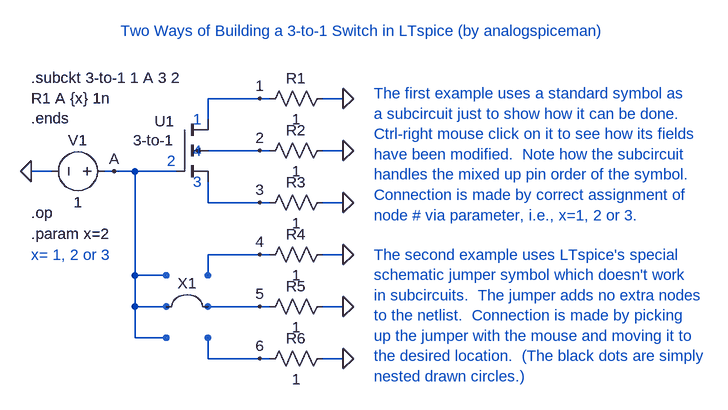
[diagram p0: schematic 3-to-1.asc]
3-to-1.asc, the LTspice schematic file:
Version 4
SHEET 1 880 680
WIRE 144 160 64 160
WIRE 160 160 144 160
WIRE 272 160 240 160
WIRE 64 192 64 160
WIRE 144 240 64 240
WIRE 160 240 144 240
WIRE 272 240 240 240
WIRE -176 272 -208 272
WIRE -80 272 -96 272
WIRE -48 272 -80 272
WIRE 16 272 -48 272
WIRE 64 320 64 288
WIRE 144 320 64 320
WIRE 160 320 144 320
WIRE 272 320 240 320
WIRE 144 400 64 400
WIRE 160 400 144 400
WIRE 272 400 240 400
WIRE -48 432 -48 272
WIRE 0 432 -48 432
WIRE 64 432 64 400
WIRE -48 480 -48 432
WIRE 0 480 -48 480
WIRE 144 480 64 480
WIRE 160 480 144 480
WIRE 272 480 240 480
WIRE -48 528 -48 480
WIRE 0 528 -48 528
WIRE 64 560 64 528
WIRE 144 560 64 560
WIRE 160 560 144 560
WIRE 272 560 240 560
FLAG -208 272 0
FLAG 272 160 0
FLAG 272 240 0
FLAG 272 320 0
FLAG 144 160 1
FLAG 144 240 2
FLAG 144 320 3
FLAG -80 272 A
FLAG 272 400 0
FLAG 272 480 0
FLAG 272 560 0
FLAG 144 400 4
FLAG 144 480 5
FLAG 144 560 6
SYMBOL nmos4 16 192 R0
WINDOW 0 -3 3 Right 0
WINDOW 3 -3 32 Right 0
SYMATTR InstName U1
SYMATTR Value 3-to-1
SYMATTR Prefix X
SYMBOL voltage -80 272 R90
WINDOW 0 -32 56 VBottom 0
WINDOW 3 32 56 VTop 0
SYMATTR InstName V1
SYMATTR Value 1
SYMBOL res 256 144 R90
WINDOW 0 0 56 VBottom 0
WINDOW 3 32 56 VTop 0
SYMATTR InstName R1
SYMATTR Value 1
SYMBOL res 256 224 R90
WINDOW 0 0 56 VBottom 0
WINDOW 3 32 56 VTop 0
SYMATTR InstName R2
SYMATTR Value 1
SYMBOL res 256 304 R90
WINDOW 0 0 56 VBottom 0
WINDOW 3 32 56 VTop 0
SYMATTR InstName R3
SYMATTR Value 1
SYMBOL res 256 384 R90
WINDOW 0 0 56 VBottom 0
WINDOW 3 32 56 VTop 0
SYMATTR InstName R4
SYMATTR Value 1
SYMBOL res 256 464 R90
WINDOW 0 0 56 VBottom 0
WINDOW 3 32 56 VTop 0
SYMATTR InstName R5
SYMATTR Value 1
SYMBOL res 256 544 R90
WINDOW 0 0 56 VBottom 0
WINDOW 3 32 56 VTop 0
SYMATTR InstName R6
SYMATTR Value 1
SYMBOL Misc\\jumper 32 416 R0
WINDOW 0 0 44 Bottom 0
SYMATTR InstName X1
TEXT 48 192 Center 0 ;1
TEXT 48 240 Center 0 ;4
TEXT 48 288 Center 0 ;3
TEXT 8 256 Center 0 ;2
TEXT -208 128 Left 0 !.subckt 3-to-1 1 A 3 2\nR1 A {x} 1n\n.ends
TEXT -208 336 Left 0 !.op
TEXT -208 368 Left 0 !.param x=2
TEXT 304 56 Center 0 ;Two Ways of Building a 3-to-1 Switch in LTspice (by analogspiceman)
TEXT 320 152 Left 0 ;The first example uses a standard symbol as \na subcircuit just to show how it can be done.\nCtrl-right mouse click on it to see how its fields \nhave been modified.  Note how the subcircuit \nhandles the mixed up pin order of the symbol.\nConnection is made by correct assignment of \nnode # via parameter, i.e., x=1, 2 or 3.
TEXT -208 400 Left 0 ;x= 1, 2 or 3
TEXT 320 400 Left 0 ;The second example uses LTspice's special\nschematic jumper symbol which doesn't work\nin subcircuits.  The jumper adds no extra nodes\nto the netlist.  Connection is made by picking\nup the jumper with the mouse and moving it to\nthe desired location.  (The black dots are simply\nnested drawn circles.)
CIRCLE Normal 60 428 68 436
CIRCLE Normal 61 429 67 435
CIRCLE Normal 62 430 66 434
CIRCLE Normal 60 524 68 532
CIRCLE Normal 61 525 67 531
CIRCLE Normal 62 526 66 530
CIRCLE Normal -4 428 4 436
CIRCLE Normal -3 429 3 435
CIRCLE Normal -2 430 2 434
CIRCLE Normal -4 476 4 484
CIRCLE Normal -3 477 3 483
CIRCLE Normal -2 478 2 482
CIRCLE Normal 60 476 68 484
CIRCLE Normal 61 477 67 483
CIRCLE Normal 62 478 66 482
CIRCLE Normal -4 524 4 532
CIRCLE Normal -3 525 3 531
CIRCLE Normal -2 526 2 530

The netlist it stands for:
* 3-to-1.asc
XU1 1 5 3 2 3-to-1  ; pins D G S B
V1 5 0 1
R1 0 1 1
R2 0 2 1
R3 0 3 1
R4 0 4 1
R5 0 5 1
R6 0 6 1
* 1
* 4
* 3
* 2
.subckt 3-to-1 1 A 3 2
R1 A {x} 1n
.ends
.op
.param x=2
* Two Ways of Building a 3-to-1 Switch in LTspice (by analogspiceman)
* The first example uses a standard symbol as
* a subcircuit just to show how it can be done.
* Ctrl-right mouse click on it to see how its fields
* have been modified.  Note how the subcircuit
* handles the mixed up pin order of the symbol.
* Connection is made by correct assignment of
* node # via parameter, i.e., x=1, 2 or 3.
* x= 1, 2 or 3
* The second example uses LTspice's special
* schematic jumper symbol which doesn't work
* in subcircuits.  The jumper adds no extra nodes
* to the netlist.  Connection is made by picking
* up the jumper with the mouse and moving it to
* the desired location.  (The black dots are simply
* nested drawn circles.)
.backanno
.end